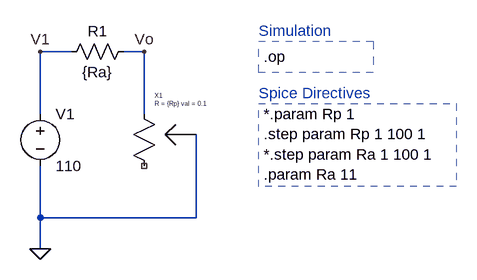
[diagram p0: schematic Example_1_Pot.asc]
Example_1_Pot.asc, the LTspice schematic file:
Version 4
SHEET 1 1432 696
WIRE 352 80 304 80
WIRE 464 80 432 80
WIRE 304 176 304 80
WIRE 464 176 464 80
WIRE 304 336 304 256
WIRE 544 336 544 208
WIRE 544 336 304 336
WIRE 304 384 304 336
FLAG 304 384 0
FLAG 304 80 V1
FLAG 464 80 Vo
SYMBOL voltage 304 160 R0
SYMATTR InstName V1
SYMATTR Value 110
SYMBOL pot 448 160 R0
WINDOW 39 32 0 Left 0
WINDOW 0 32 -12 Left 0
SYMATTR SpiceLine R = {Rp} val = 0.1
SYMATTR InstName X1
SYMBOL res 448 64 R90
WINDOW 0 0 56 VBottom 2
WINDOW 3 32 56 VTop 2
SYMATTR InstName R1
SYMATTR Value {Ra}
TEXT 640 48 Left 2 ;Simulation
TEXT 648 88 Left 2 !.op
TEXT 640 144 Left 2 ;Spice Directives
TEXT 648 176 Left 2 !*.param Rp 1\n.step param Rp 1 100 1\n*.step param Ra 1 100 1\n.param Ra 11
RECTANGLE Normal 816 112 640 64 2
RECTANGLE Normal 944 288 640 160 2

The netlist it stands for:
* Example_1_Pot.asc
V1 V1 0 110
XX1 Vo 0 NC_01 pot R = {Rp} val = 0.1  ; pins 1 2 3
R1 Vo V1 {Ra}
* Simulation
.op
* Spice Directives
*.param Rp 1
.step param Rp 1 100 1
*.step param Ra 1 100 1
.param Ra 11
.backanno
.end